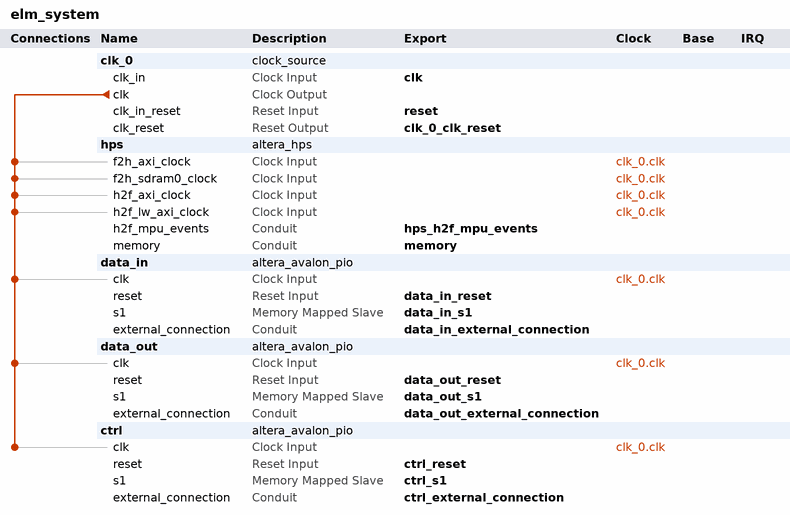
[diagram p0: system contents]
# Platform Designer (Qsys) system elm_system, Cyclone V 5CSEMA5F31C6
# Parameters at their usual value, and those the tool derives, are not listed.
package require -exact qsys 24.1
create_system elm_system
set_project_property DEVICE_FAMILY {Cyclone V}
set_project_property DEVICE 5CSEMA5F31C6

add_instance clk_0 clock_source 24.1
set_instance_parameter_value clk_0 clockFrequency 50000000

add_instance hps altera_hps 24.1
set_instance_parameter_value hps EMAC1_Mode N/A
set_instance_parameter_value hps EMAC1_PinMuxing Unused
set_instance_parameter_value hps F2SCLK_COLDRST_Enable false
set_instance_parameter_value hps F2SCLK_DBGRST_Enable false
set_instance_parameter_value hps F2SCLK_WARMRST_Enable false
set_instance_parameter_value hps F2SDRAM_Type AXI-3
set_instance_parameter_value hps F2SDRAM_Width 64
set_instance_parameter_value hps F2SINTERRUPT_Enable false
set_instance_parameter_value hps F2S_Width 2
set_instance_parameter_value hps FPGA_PERIPHERAL_OUTPUT_CLOCK_FREQ_EMAC0_GTX_CLK 125
set_instance_parameter_value hps FPGA_PERIPHERAL_OUTPUT_CLOCK_FREQ_EMAC0_MD_CLK 2.5
set_instance_parameter_value hps FPGA_PERIPHERAL_OUTPUT_CLOCK_FREQ_EMAC1_GTX_CLK 125
set_instance_parameter_value hps FPGA_PERIPHERAL_OUTPUT_CLOCK_FREQ_EMAC1_MD_CLK 2.5
set_instance_parameter_value hps HPS_PROTOCOL DDR3
set_instance_parameter_value hps I2C0_Mode N/A
set_instance_parameter_value hps I2C0_PinMuxing Unused
set_instance_parameter_value hps I2C1_Mode N/A
set_instance_parameter_value hps I2C1_PinMuxing Unused
set_instance_parameter_value hps LWH2F_Enable true
set_instance_parameter_value hps MEM_BANKADDR_WIDTH 3
set_instance_parameter_value hps MEM_CLK_FREQ 300.0
set_instance_parameter_value hps MEM_CLK_FREQ_MAX 400.0
set_instance_parameter_value hps MEM_COL_ADDR_WIDTH 10
set_instance_parameter_value hps MEM_DQ_WIDTH 32
set_instance_parameter_value hps MEM_DRV_STR RZQ/6
set_instance_parameter_value hps MEM_ROW_ADDR_WIDTH 15
set_instance_parameter_value hps MEM_RTT_NOM {ODT Disabled}
set_instance_parameter_value hps MEM_RTT_WR {Dynamic ODT off}
set_instance_parameter_value hps MEM_TCL 7
set_instance_parameter_value hps MEM_TFAW_NS 37.5
set_instance_parameter_value hps MEM_TINIT_US 499
set_instance_parameter_value hps MEM_TMRD_CK 3
set_instance_parameter_value hps MEM_TRAS_NS 40.0
set_instance_parameter_value hps MEM_TRCD_NS 15.0
set_instance_parameter_value hps MEM_TREFI_US 7.0
set_instance_parameter_value hps MEM_TRFC_NS 75.0
set_instance_parameter_value hps MEM_TRP_NS 15.0
set_instance_parameter_value hps MEM_TWTR 2
set_instance_parameter_value hps MEM_VENDOR JEDEC
set_instance_parameter_value hps MEM_WTCL 6
set_instance_parameter_value hps MPU_EVENTS_Enable true
set_instance_parameter_value hps QSPI_Mode N/A
set_instance_parameter_value hps QSPI_PinMuxing Unused
set_instance_parameter_value hps REF_CLK_FREQ 125.0
set_instance_parameter_value hps S2FCLK_USER2CLK 5
set_instance_parameter_value hps S2F_Width 2
set_instance_parameter_value hps SDIO_Mode N/A
set_instance_parameter_value hps SDIO_PinMuxing Unused
set_instance_parameter_value hps SPIM1_Mode N/A
set_instance_parameter_value hps SPIM1_PinMuxing Unused
set_instance_parameter_value hps STM_Enable false
set_instance_parameter_value hps TIMING_BOARD_AC_SKEW 0.02
set_instance_parameter_value hps TIMING_BOARD_AC_TO_CK_SKEW 0.0
set_instance_parameter_value hps TIMING_BOARD_DQ_TO_DQS_SKEW 0.0
set_instance_parameter_value hps TIMING_BOARD_MAX_CK_DELAY 0.6
set_instance_parameter_value hps TIMING_BOARD_MAX_DQS_DELAY 0.6
set_instance_parameter_value hps TIMING_BOARD_SKEW_BETWEEN_DQS 0.02
set_instance_parameter_value hps TIMING_BOARD_SKEW_CKDQS_DIMM_MAX 0.01
set_instance_parameter_value hps TIMING_BOARD_SKEW_CKDQS_DIMM_MIN -0.01
set_instance_parameter_value hps TIMING_BOARD_SKEW_WITHIN_DQS 0.02
set_instance_parameter_value hps TIMING_TDH 125
set_instance_parameter_value hps TIMING_TDQSCK 400
set_instance_parameter_value hps TIMING_TDQSQ 120
set_instance_parameter_value hps TIMING_TDS 50
set_instance_parameter_value hps TIMING_TIH 250
set_instance_parameter_value hps TIMING_TIS 175
set_instance_parameter_value hps TIMING_TQSH 0.38
set_instance_parameter_value hps UART0_Mode N/A
set_instance_parameter_value hps UART0_PinMuxing Unused
set_instance_parameter_value hps USB1_Mode N/A
set_instance_parameter_value hps USB1_PinMuxing Unused
set_instance_parameter_value hps desired_cfg_clk_mhz 100.0
set_instance_parameter_value hps desired_qspi_clk_mhz 400.0

add_instance data_in altera_avalon_pio 24.1
set_instance_parameter_value data_in direction Output
set_instance_parameter_value data_in width 32

add_instance data_out altera_avalon_pio 24.1
set_instance_parameter_value data_out direction Output
set_instance_parameter_value data_out width 32

add_instance ctrl altera_avalon_pio 24.1
set_instance_parameter_value ctrl direction Output
set_instance_parameter_value ctrl width 3

# connections
add_connection clk_0.clk ctrl.clk clock
add_connection clk_0.clk data_in.clk clock
add_connection clk_0.clk data_out.clk clock
add_connection clk_0.clk hps.f2h_axi_clock clock
add_connection clk_0.clk hps.f2h_sdram0_clock clock
add_connection clk_0.clk hps.h2f_axi_clock clock
add_connection clk_0.clk hps.h2f_lw_axi_clock clock

# exported interfaces
add_interface clk clock sink
set_interface_property clk EXPORT_OF clk_0.clk_in
add_interface clk_0_clk_reset reset source
set_interface_property clk_0_clk_reset EXPORT_OF clk_0.clk_reset
add_interface ctrl_external_connection conduit end
set_interface_property ctrl_external_connection EXPORT_OF ctrl.external_connection
add_interface ctrl_reset reset sink
set_interface_property ctrl_reset EXPORT_OF ctrl.reset
add_interface ctrl_s1 avalon slave
set_interface_property ctrl_s1 EXPORT_OF ctrl.s1
add_interface data_in_external_connection conduit end
set_interface_property data_in_external_connection EXPORT_OF data_in.external_connection
add_interface data_in_reset reset sink
set_interface_property data_in_reset EXPORT_OF data_in.reset
add_interface data_in_s1 avalon slave
set_interface_property data_in_s1 EXPORT_OF data_in.s1
add_interface data_out_external_connection conduit end
set_interface_property data_out_external_connection EXPORT_OF data_out.external_connection
add_interface data_out_reset reset sink
set_interface_property data_out_reset EXPORT_OF data_out.reset
add_interface data_out_s1 avalon slave
set_interface_property data_out_s1 EXPORT_OF data_out.s1
add_interface hps_h2f_mpu_events conduit end
set_interface_property hps_h2f_mpu_events EXPORT_OF hps.h2f_mpu_events
add_interface memory conduit end
set_interface_property memory EXPORT_OF hps.memory
add_interface reset reset sink
set_interface_property reset EXPORT_OF clk_0.clk_in_reset

set_interconnect_requirement {$system} qsys_mm.clockCrossingAdapter HANDSHAKE
set_interconnect_requirement {$system} qsys_mm.enableEccProtection FALSE
set_interconnect_requirement {$system} qsys_mm.insertDefaultSlave FALSE
set_interconnect_requirement {$system} qsys_mm.maxAdditionalLatency 1

save_system elm_system.qsys
